# EAGLE schematic VF_Sine_CPU_Mainboard2 (EAGLE 6.6.0)
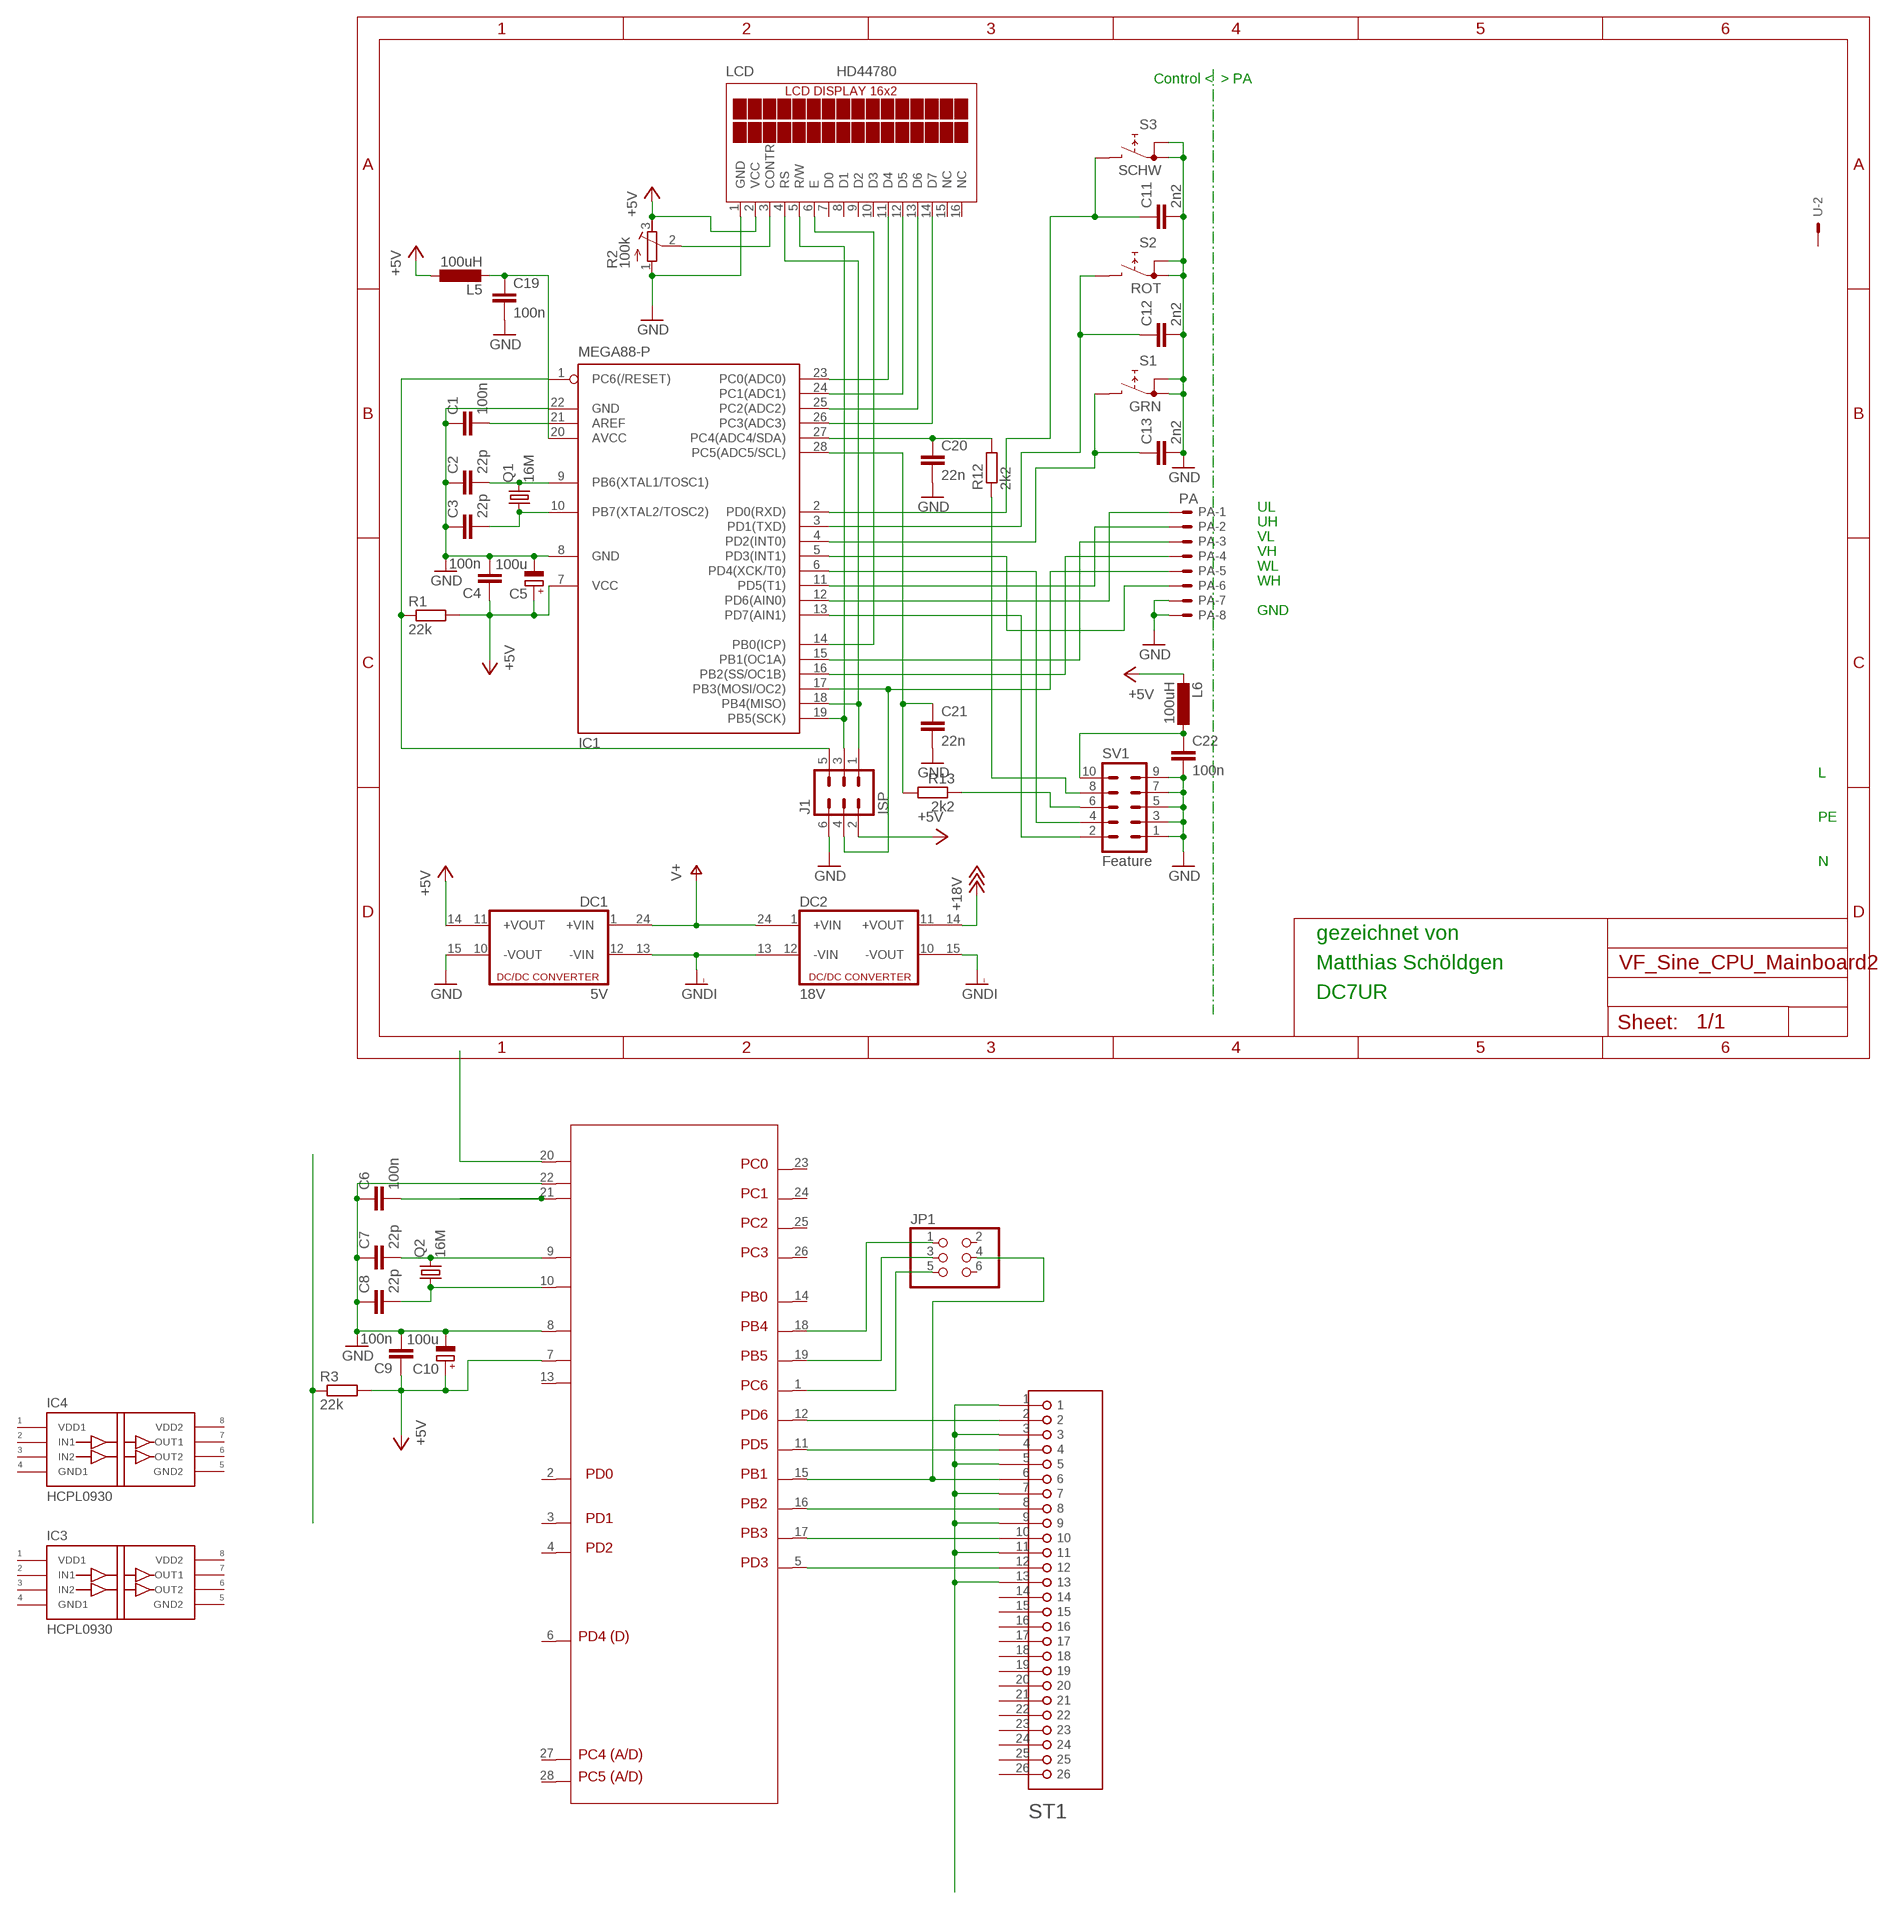
[diagram p0: schematic, sheet 1]

## Parts
C1  100n  C-EU025-025X050  [C025-025X050]
C2  22p  C-EU025-025X050  [C025-025X050]
C3  22p  C-EU025-025X050  [C025-025X050]
C4  100n  C-EU025-025X050  [C025-025X050]
C5  100u  CPOL-EUB45181A  [B45181A]
C6  100n  C-EU025-025X050  [C025-025X050]
C7  22p  C-EU025-025X050  [C025-025X050]
C8  22p  C-EU025-025X050  [C025-025X050]
C9  100n  C-EU025-025X050  [C025-025X050]
C10  100u  CPOL-EUB45181A  [B45181A]
C11  2n2  C-EU025-025X050  [C025-025X050]
C12  2n2  C-EU025-025X050  [C025-025X050]
C13  2n2  C-EU025-025X050  [C025-025X050]
C19  100n  C-EU050-030X075  [C050-030X075]
C20  22n  C-EU025-024X044  [C025-024X044]
C21  22n  C-EU025-024X044  [C025-024X044]
C22  100n  C-EU025-025X050  [C025-025X050]
DC1  5V  DC213R  [CMK]
DC2  18V  DC213R  [CMK]
IC1  MEGA88-P  MEGA8-P  [DIL28-3]
IC2  ATMEGA328P_VAR  [DIL-28S]
IC3  HCPL0930  [SO8]
IC4  HCPL0930  [SO8]
J1  ISP  ML6  [ML6]
JP1  PINHD-2X3  [2X03]
L5  100uH  L-EU0204/5  [0204/5]
L6  100uH  L-EU0204/5  [0204/5]
LCD  HD44780  TUXGR_16X2_R2  [TUXGR_16X2_R2]
PA  PA  22-23-2081  [22-23-2081]
Q1  16M  CRYSTALHC49S  [HC49/S]
Q2  16M  CRYSTALHC49S  [HC49/S]
R1  22k  R-EU_0207/2V  [0207/2V]
R2  100k  R-TRIMM4G/J  [RTRIM4G/J]
R3  22k  R-EU_0207/2V  [0207/2V]
R12  2k2  R-EU_0204/5  [0204/5]
R13  2k2  R-EU_0204/5  [0204/5]
S1  GRN  RDT1034  [RDT1034]
S2  ROT  RDT1034  [RDT1034]
S3  SCHW  RDT1034  [RDT1034]
ST1  HD-26  [HD-26]
SV1  Feature  ML10  [ML10]
U  5566-2  [5566-2]

## Nets
+5V: C4.1 C5.+ C9.1 C10.+ DC1.14(+VOUT1) IC1.7(VCC) IC2.7 J1.2 L5.1 L6.2 LCD.2(VCC) R1.2 R2.3(A) R3.2
+18V: DC2.14(+VOUT1)
GND: C1.1 C2.1 C3.1 C4.2 C5.- C6.1 C7.1 C8.1 C9.2 C10.- C11.2 C12.2 C13.2 C19.2 C20.2 C21.2 C22.2 DC1.15(-VOUT1) IC1.8(GND) IC1.22(GND) IC2.8 IC2.22 J1.6 LCD.1(GND) PA.7 PA.8 R2.1(E) S1.A S1.A1 S2.A S2.A1 S3.A S3.A1 SV1.1 SV1.3 SV1.5 SV1.7 SV1.9
GNDI: DC1.13(-VIN1) DC2.13(-VIN1) DC2.15(-VOUT1)
N$1: IC1.18(PB4(MISO)) J1.1 LCD.4(RS)
N$2: IC1.19(PB5(SCK)) J1.3 LCD.5(R/W)
N$3: IC1.17(PB3(MOSI/OC2)) J1.4 PA.5
N$4: IC1.1(PC6(/RESET)) J1.5 R1.1
N$5: IC1.12(PD6(AIN0)) PA.1
N$6: IC1.11(PD5(T1)) PA.2
N$7: IC1.15(PB1(OC1A)) PA.3
N$8: IC1.16(PB2(SS/OC1B)) PA.4
N$9: IC1.5(PD3(INT1)) PA.6
N$10: IC1.23(PC0(ADC0)) LCD.11(D4)
N$11: IC1.24(PC1(ADC1)) LCD.12(D5)
N$12: IC1.25(PC2(ADC2)) LCD.13(D6)
N$13: C1.2 IC1.21(AREF)
N$14: C2.2 IC1.9(PB6(XTAL1/TOSC1)) Q1.2
N$15: C3.2 IC1.10(PB7(XTAL2/TOSC2)) Q1.1
N$16: IC1.26(PC3(ADC3)) LCD.14(D7)
N$17: IC1.13(PD7(AIN1)) SV1.2
N$18: IC1.14(PB0(ICP)) LCD.6(E)
N$19: LCD.3(CONTR) R2.2(S)
N$20: IC1.6(PD4(XCK/T0)) SV1.4
N$21: R12.1 SV1.8
N$22: R13.1 SV1.6
N$23: C13.1 IC1.4(PD2(INT0)) S1.B
N$24: C12.1 IC1.3(PD1(TXD)) S2.B
N$25: C11.1 IC1.2(PD0(RXD)) S3.B
N$26: ST1.1 ST1.3 ST1.5 ST1.7 ST1.9 ST1.11 ST1.13
N$27: IC2.12 ST1.2
N$28: IC2.11 ST1.4
N$29: IC2.15 JP1.4 ST1.6
N$30: IC2.16 ST1.8
N$31: IC2.17 ST1.10
N$32: IC2.5 ST1.12
N$33: IC2.18 JP1.1
N$34: IC2.19 JP1.3
N$35: IC2.1 JP1.5
N$36: C19.1 IC1.20(AVCC) L5.2
N$37: C20.1 IC1.27(PC4(ADC4/SDA)) R12.2
N$38: C21.1 IC1.28(PC5(ADC5/SCL)) R13.2
N$40: R3.1
N$41: C6.2 IC2.21
N$42: C7.2 IC2.9 Q2.2
N$43: C8.2 IC2.10 Q2.1
N$44: IC2.20
N$51: C22.1 L6.1 SV1.10
V+: DC1.24(+VIN1) DC2.24(+VIN1)
Unconnected: DC1.1(+VIN) DC1.10(-VOUT) DC1.11(+VOUT) DC1.12(-VIN) DC2.1(+VIN) DC2.10(-VOUT) DC2.11(+VOUT) DC2.12(-VIN) IC2.2 IC2.3 IC2.4 IC2.6 IC2.13 IC2.14 IC2.23 IC2.24 IC2.25 IC2.26 IC2.27 IC2.28 IC3.1 IC3.2 IC3.3 IC3.4 IC3.5 IC3.6 IC3.7 IC3.8 IC4.1 IC4.2 IC4.3 IC4.4 IC4.5 IC4.6 IC4.7 IC4.8 JP1.2 JP1.6 LCD.7(D0) LCD.8(D1) LCD.9(D2) LCD.10(D3) LCD.15(NC) LCD.16(NC) ST1.14 ST1.15 ST1.16 ST1.17 ST1.18 ST1.19 ST1.20 ST1.21 ST1.22 ST1.23 ST1.24 ST1.25 ST1.26 U.1 U.2

## Notes on the sheet
- Control <  > PA
- UL
- UH
- VL
- VH
- WL
- WH
- GND
- L
- PE
- N
- gezeichnet von
- Matthias Schöldgen
- DC7UR
- PC0
- PC1
- PC2
- PC3
- PB0
- PB4
- PB5
- PC6
- PD6
- PD5
- PD0 | PB1
- PB2
- PD1
- PB3
- PD2
- PD3
- PD4 (D)
- PC4 (A/D)
- PC5 (A/D)

## Library data of the parts
C1-C4 C6-C9 C11-C13 C19-C22 = rcl:C-EU: CAPACITOR, European symbol
C5 C10 = rcl:CPOL-EU: POLARIZED CAPACITOR, European symbol
DC1 DC2 = dc-dc-converter:DC213R: DC-DC CONVERTER
IC1 = atmel:MEGA8-P: MICROCONTROLLER 8 Kbytes FLASH, 1 kbytes SRAM, 512 bytes EEPROM, USART, 4-channel 10 bit ADC, 2-channel 8 bit ADC Pin compatible with Atmega48, ATMega88, ATMega168 Source: avr.lbr
IC2 = PAL:ATMEGA328P_VAR
IC3 IC4 = OPTOKOPPLER:HCPL0930
J1 = con-ml:ML6: HARTING
JP1 = pinhead:PINHD-2X3: PIN HEADER
L5 L6 = rcl:L-EU: INDUCTOR, European symbol
LCD = display-lcd:TUXGR_16X2_R2: Tuxgraphics LCD display 16x2 characters reflective, without background light Source: tuxgr_12x2_r2.pdf
PA = con-molex:22-23-2081: .100" (2.54mm) Center Header - 8 Pin
Q1 Q2 = crystal:CRYSTAL: CRYSTAL
R1 R3 R12 R13 = rcl:R-EU_: RESISTOR, European symbol
R2 = rcl:R-TRIMM: Trimm resistor
S1-S3 = switch:RDT1034: PUSH SWITCH www.radiohm.com
ST1 = CONNECT:HD-26
SV1 = con-ml:ML10: HARTING
U = con-molex:5566-2: Mini FIT connector 2 pol Source: http://www.molex.com